# Altium schematic sheet eps_adc.SchDoc
size A4
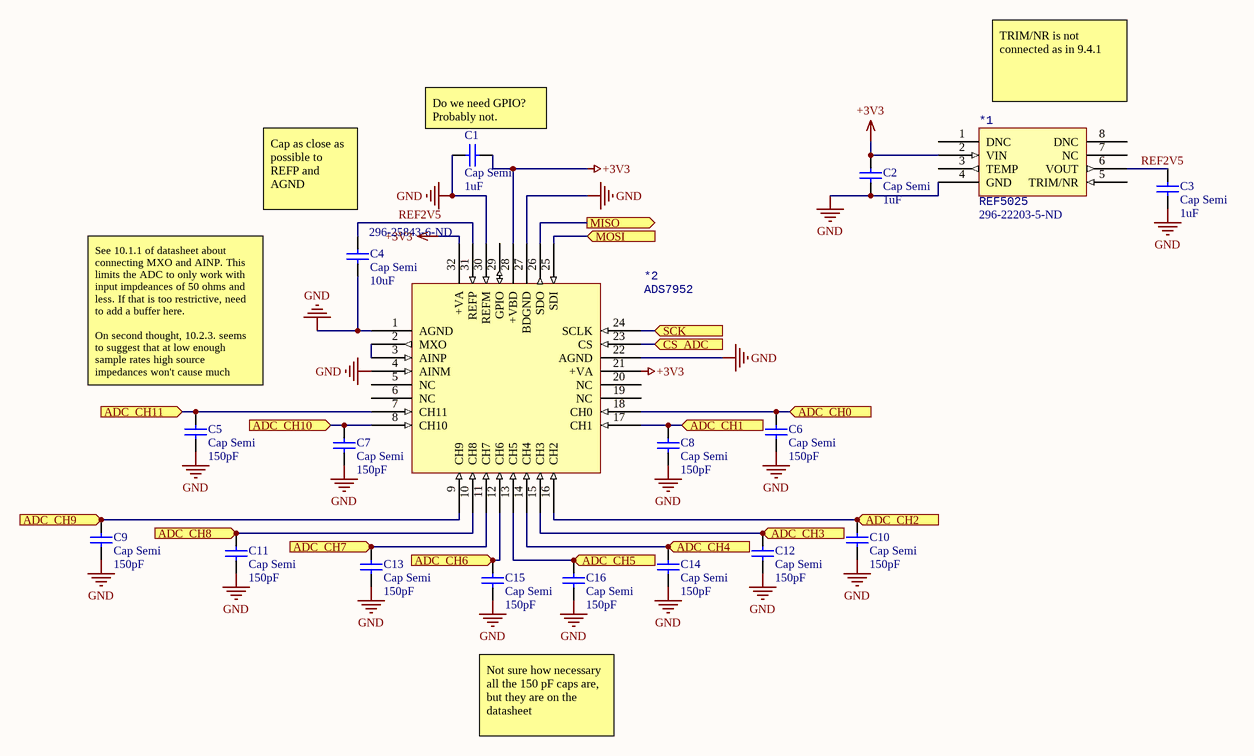
[diagram p0: eps_adc.SchDoc]

## Parts
*1  REF5025  Supplier Part Number 1: 296-22203-5-ND  [DGK8-M]
*2  ADS7952  Supplier Part Number 1: 296-25843-6-ND  [QFN50P500X500X100-32N]
C1  Cap Semi  value 1uF  [1608[0603]]
C2  Cap Semi  value 1uF  [1608[0603]]
C3  Cap Semi  value 1uF  [1608[0603]]
C4  Cap Semi  value 10uF  [1608[0603]]
C5  Cap Semi  value 150pF  [1608[0603]]
C6  Cap Semi  value 150pF  [1608[0603]]
C7  Cap Semi  value 150pF  [1608[0603]]
C8  Cap Semi  value 150pF  [1608[0603]]
C9  Cap Semi  value 150pF  [1608[0603]]
C10  Cap Semi  value 150pF  [1608[0603]]
C11  Cap Semi  value 150pF  [1608[0603]]
C12  Cap Semi  value 150pF  [1608[0603]]
C13  Cap Semi  value 150pF  [1608[0603]]
C14  Cap Semi  value 150pF  [1608[0603]]
C15  Cap Semi  value 150pF  [1608[0603]]
C16  Cap Semi  value 150pF  [1608[0603]]

## Ports
ADC_CH0 (in), ADC_CH1 (in), ADC_CH2 (in), ADC_CH3 (in), ADC_CH4 (in), ADC_CH5 (in), ADC_CH6 (in), ADC_CH7 (in), ADC_CH8 (in), ADC_CH9 (in), ADC_CH10 (in), ADC_CH11 (in), CS_ADC (in), MISO (out), MOSI (in), SCK (in)

## Nets
+3V3: *1.2(VIN) *2.21(+VA) *2.28(+VBD) *2.32(+VA) C1.1 C2.2
GND: *1.4(GND) *2.1(AGND) *2.4(AINM) *2.22(AGND) *2.27(BDGND) *2.30(REFM) C1.2 C2.1 C3.1 C4.2 C5.2 C6.2 C7.2 C8.2 C9.2 C10.2 C11.2 C12.2 C13.2 C14.2 C15.2 C16.2
ADC_CH0: *2.18(CH0) C6.1 ; port ADC_CH0
ADC_CH1: *2.17(CH1) C8.1 ; port ADC_CH1
ADC_CH2: *2.16(CH2) C10.1 ; port ADC_CH2
ADC_CH3: *2.15(CH3) C12.1 ; port ADC_CH3
ADC_CH4: *2.14(CH4) C14.1 ; port ADC_CH4
ADC_CH5: *2.13(CH5) C16.1 ; port ADC_CH5
ADC_CH6: *2.12(CH6) C15.1 ; port ADC_CH6
ADC_CH7: *2.11(CH7) C13.1 ; port ADC_CH7
ADC_CH8: *2.10(CH8) C11.1 ; port ADC_CH8
ADC_CH9: *2.9(CH9) C9.1 ; port ADC_CH9
ADC_CH10: *2.8(CH10) C7.1 ; port ADC_CH10
ADC_CH11: *2.7(CH11) C5.1 ; port ADC_CH11
CS_ADC: *2.23(CS) ; port CS_ADC
MISO: *2.26(SDO) ; port MISO
MOSI: *2.25(SDI) ; port MOSI
REF2V5: *1.6(VOUT) *2.31(REFP) C3.2 C4.1
SCK: *2.24(SCLK) ; port SCK
Net*2_2: *2.2(MXO) *2.3(AINP)

Not connected (* = marked no-connect by the designer): *1 1(DNC) 3(TEMP) 5(TRIM/NR) 7(NC) 8(DNC); *2 5(NC) 6(NC) 19(NC) 20(NC) 29(GPIO)

## Notes on the sheet
- (near C1) Do we need GPIO? Probably not.
- (near *1) TRIM/NR is not connected as in 9.4.1
- (near C4) Cap as close as possible to REFP and AGND
- (near C5) See 10.1.1 of datasheet about connecting MXO and AINP. This limits the ADC to only work with input impdeances of 50 ohms and less. If that is too restrictive, need to add a buffer here.
  On second thought, 10.2.3. seems to suggest that at low enough sample rates high source impedances won't cause much issue.
- Not sure how necessary all the 150 pF caps are, but they are on the datasheet

## Library data of the parts
*1 = REF5025: Voltage Reference; Supplier 1: Digi-Key
*2 = ADS7952: ADC; Supplier 1: Digi-Key
C1-C16 = Cap Semi: Capacitor (Semiconductor SIM Model); Published: 8-Jun-2000; LatestRevisionDate: 29-May-2009; LatestRevisionNote: IPC-7351 Footprint Added.; PackageReference: C1206; Publisher: Altium Limited; PackageDescription: Chip Capacitor